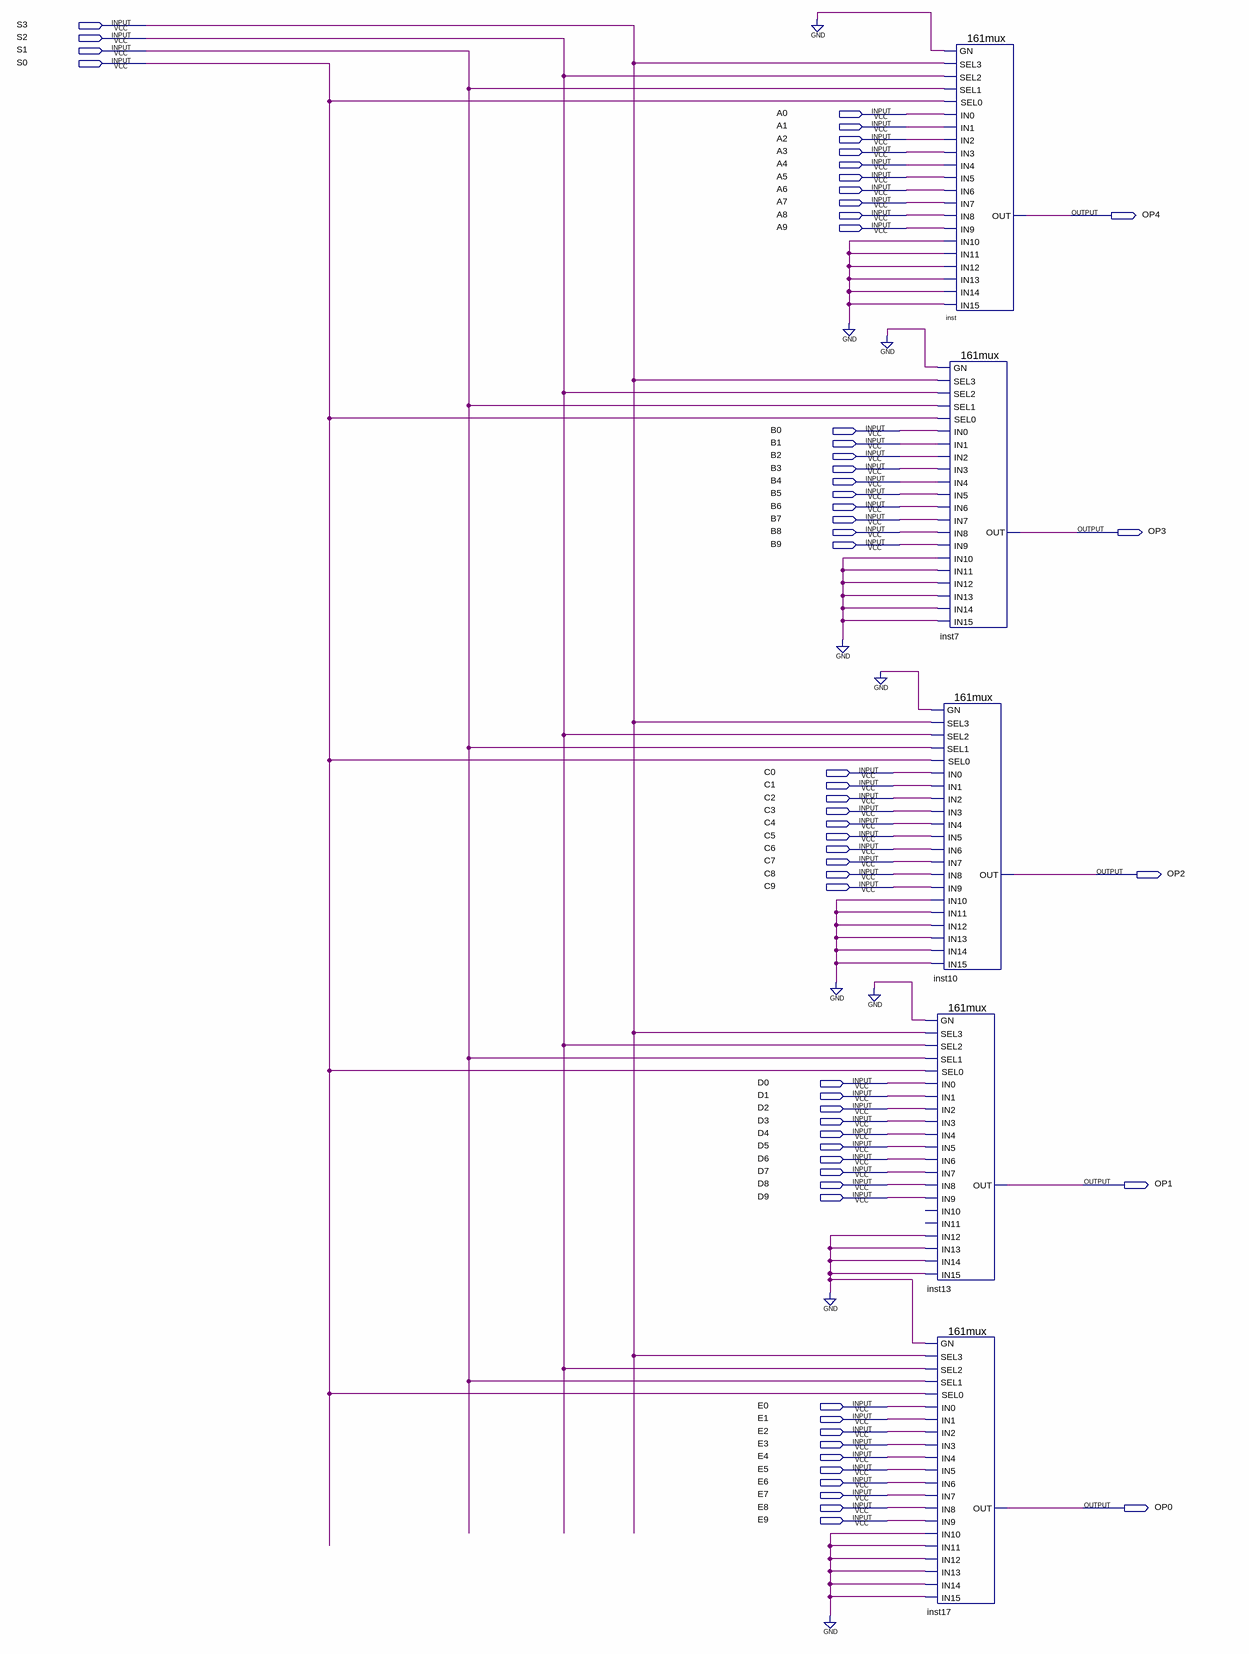
[diagram p0: schematic sheet]
// Quartus schematic MUXTIPOROUTIPOSI.bdf as structural Verilog: 5 symbols, 59 pins
module MUXTIPOROUTIPOSI (
  input  S3,
  input  S2,
  input  S1,
  input  S0,
  input  A0,
  input  A1,
  input  A2,
  input  A3,
  input  A4,
  input  A5,
  input  A6,
  input  A7,
  input  A8,
  input  A9,
  input  B0,
  input  B1,
  input  B2,
  input  B3,
  input  B4,
  input  B5,
  input  B6,
  input  B7,
  input  B8,
  input  B9,
  input  C0,
  input  C1,
  input  C2,
  input  C3,
  input  C4,
  input  C5,
  input  C6,
  input  C7,
  input  C8,
  input  C9,
  input  D0,
  input  D1,
  input  D2,
  input  D3,
  input  D4,
  input  D5,
  input  D6,
  input  D7,
  input  D8,
  input  D9,
  input  E0,
  input  E1,
  input  E2,
  input  E3,
  input  E4,
  input  E5,
  input  E6,
  input  E7,
  input  E8,
  input  E9,
  output OP4,
  output OP3,
  output OP2,
  output OP1,
  output OP0
);

  \161mux  inst7 (
    .SEL3(S3), .GN(1'b0), .IN0(B0), .SEL0(S0), .SEL1(S1), .SEL2(S2), .IN3(B3), .IN2(B2), .IN1(B1), .IN6(B6),
    .IN5(B5), .IN4(B4), .IN9(B9), .IN8(B8), .IN7(B7), .IN11(1'b0), .IN12(1'b0), .IN10(1'b0), .IN15(1'b0),
    .IN14(1'b0), .IN13(1'b0), .OUT(OP3));
  \161mux  inst10 (
    .SEL3(S3), .GN(1'b0), .IN0(C0), .SEL0(S0), .SEL1(S1), .SEL2(S2), .IN3(C3), .IN2(C2), .IN1(C1), .IN6(C6),
    .IN5(C5), .IN4(C4), .IN9(C9), .IN8(C8), .IN7(C7), .IN11(1'b0), .IN12(1'b0), .IN10(1'b0), .IN15(1'b0),
    .IN14(1'b0), .IN13(1'b0), .OUT(OP2));
  \161mux  inst13 (
    .SEL3(S3), .GN(1'b0), .IN0(D0), .SEL0(S0), .SEL1(S1), .SEL2(S2), .IN3(D3), .IN2(D2), .IN1(D1), .IN6(D6),
    .IN5(D5), .IN4(D4), .IN9(D9), .IN8(D8), .IN7(D7), .IN12(1'b0), .IN15(1'b0), .IN14(1'b0), .IN13(1'b0),
    .OUT(OP1));  // open: IN11, IN10
  \161mux  inst17 (
    .SEL3(S3), .GN(1'b0), .IN0(E0), .SEL0(S0), .SEL1(S1), .SEL2(S2), .IN3(E3), .IN2(E2), .IN1(E1), .IN6(E6),
    .IN5(E5), .IN4(E4), .IN9(E9), .IN8(E8), .IN7(E7), .IN11(1'b0), .IN12(1'b0), .IN10(1'b0), .IN15(1'b0),
    .IN14(1'b0), .IN13(1'b0), .OUT(OP0));
  \161mux  inst (
    .SEL3(S3), .GN(1'b0), .IN0(A0), .SEL0(S0), .SEL1(S1), .SEL2(S2), .IN3(A3), .IN2(A2), .IN1(A1), .IN6(A6),
    .IN5(A5), .IN4(A4), .IN9(A9), .IN8(A8), .IN7(A7), .IN11(1'b0), .IN12(1'b0), .IN10(1'b0), .IN15(1'b0),
    .IN14(1'b0), .IN13(1'b0), .OUT(OP4));
endmodule
